# Altium project Servo-Board-v1.0.PrjPcb (part 17 of 19)

## Sheet Sec_Controller_Sheet4.SchDoc
size 420 x 297 mm; SheetNumber: 28; SheetTotal: 32
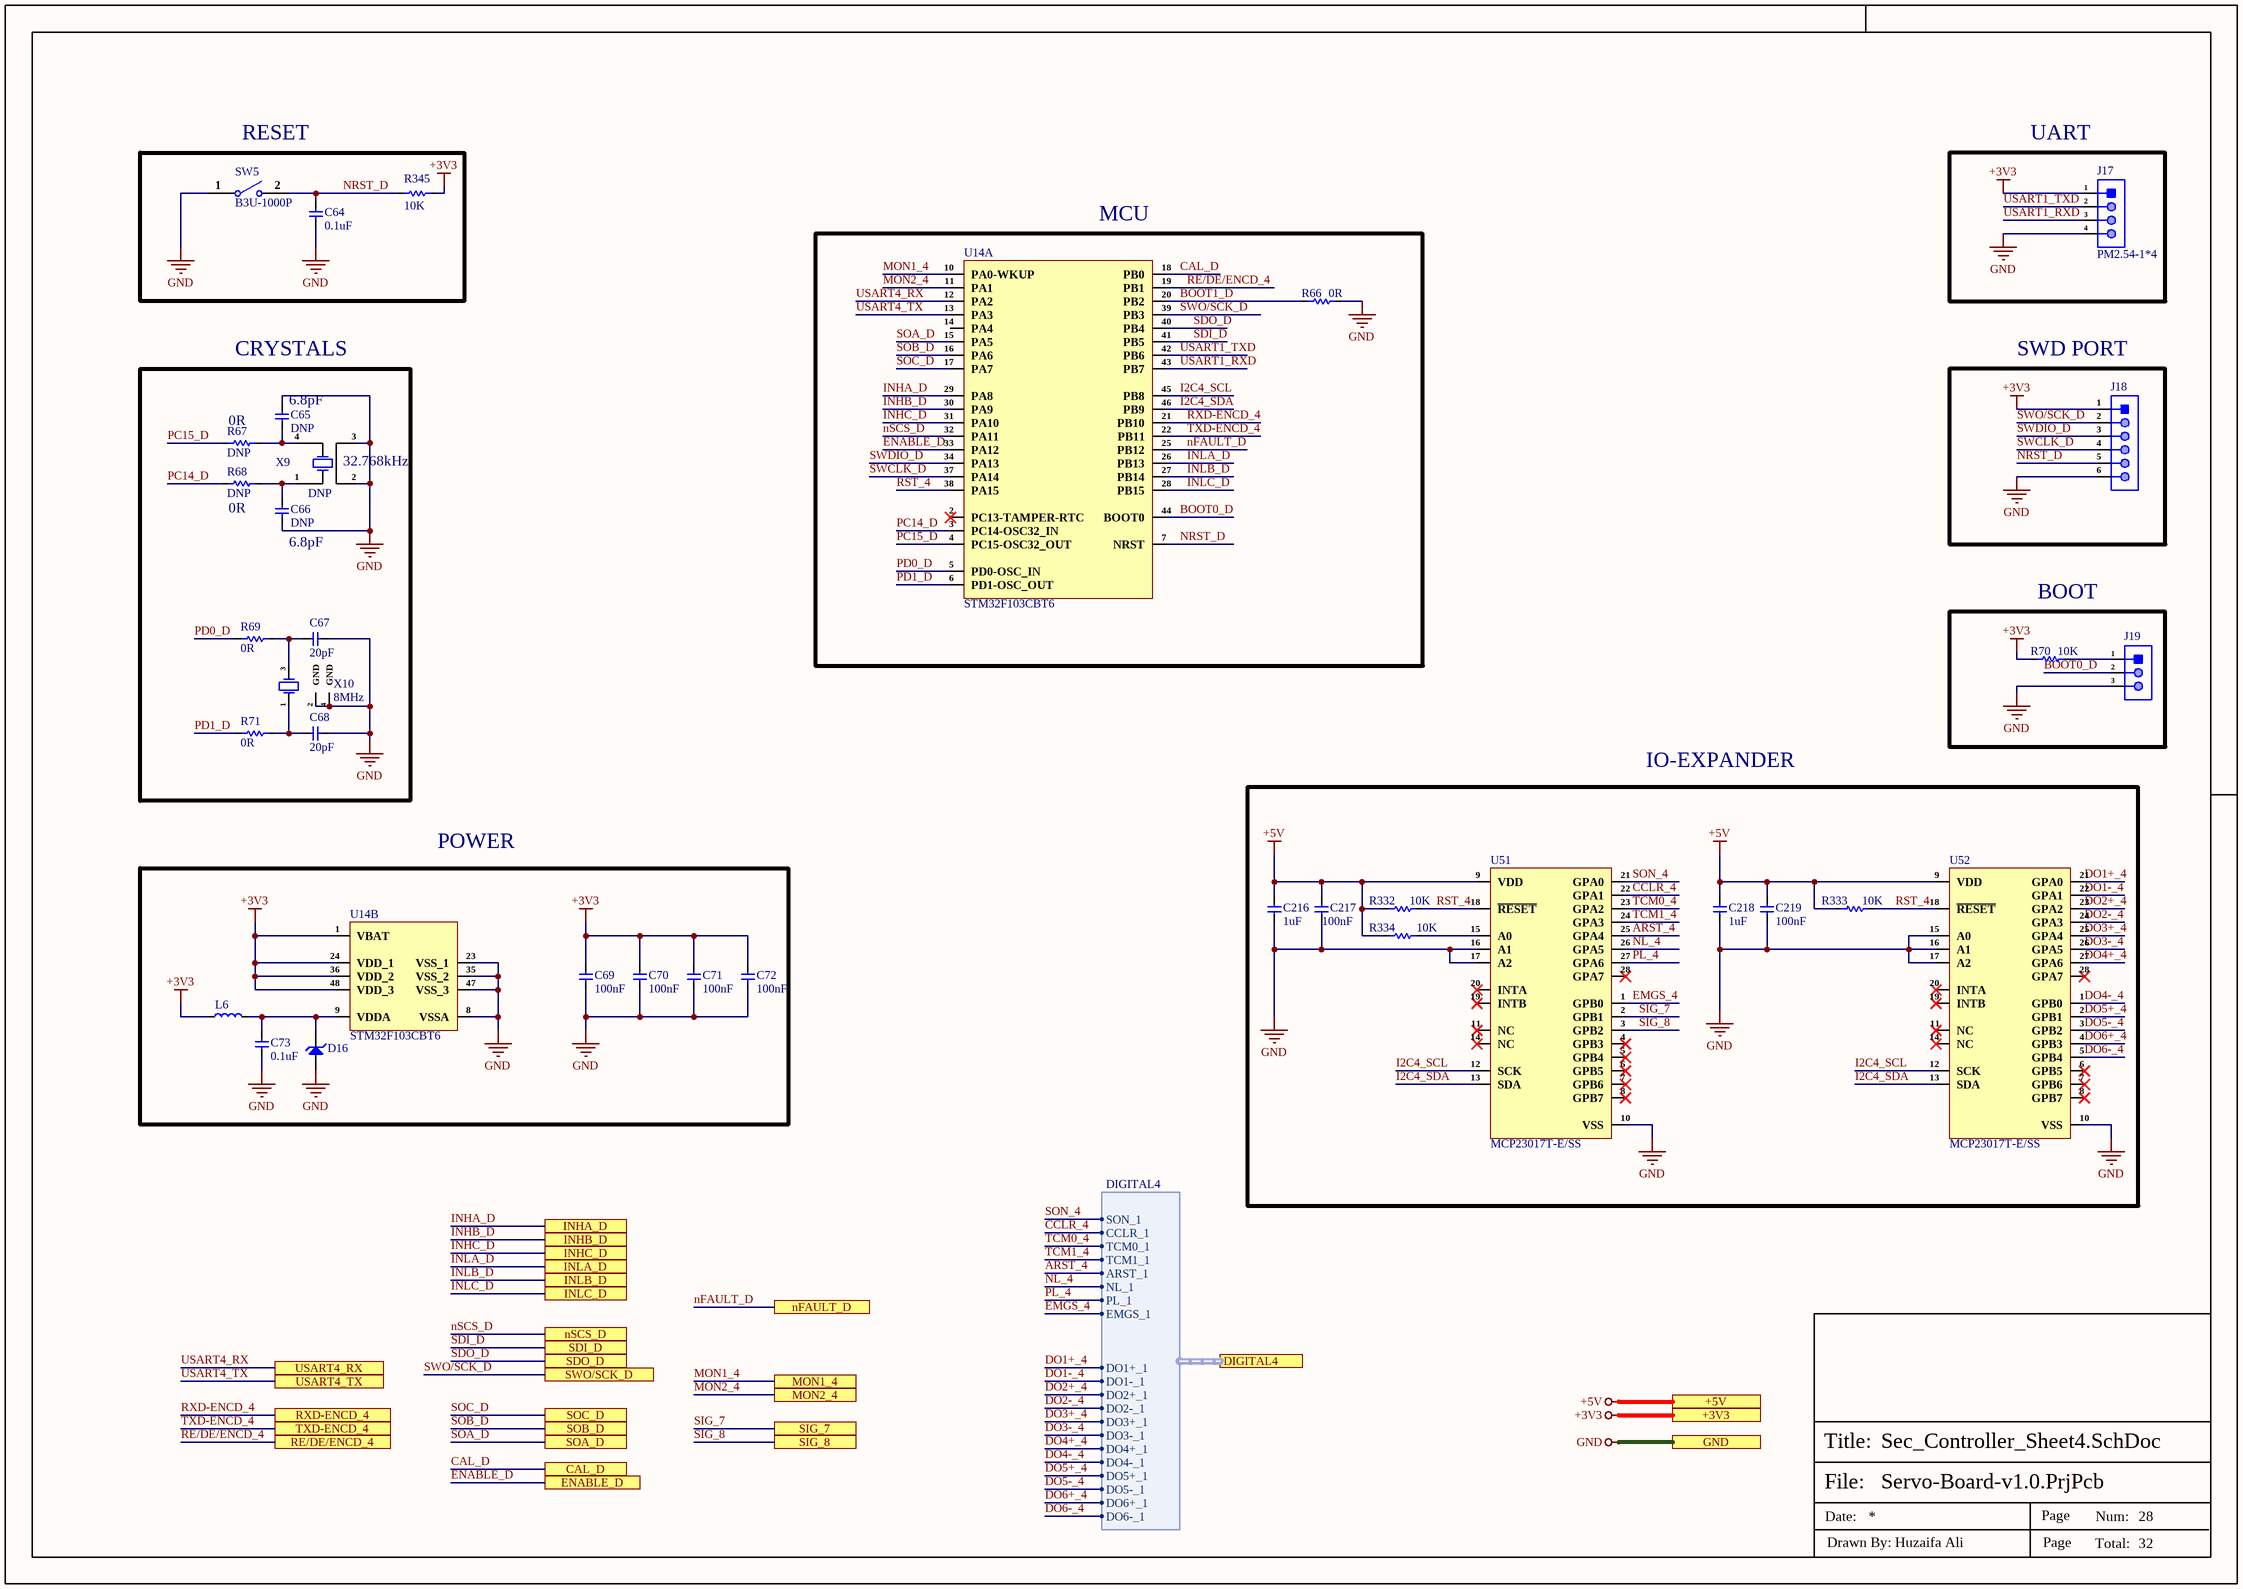
[diagram p29: Sec_Controller_Sheet4.SchDoc]

### Parts
C64  0.1uF  [Cap-0402]
C65  DNP  [Cap-0402]
C66  DNP  [Cap-0402]
C67  20pF  [Cap-0402]
C68  20pF  [Cap-0402]
C69  100nF  [cap-0402]
C70  100nF  [cap-0402]
C71  100nF  [cap-0402]
C72  100nF  [cap-0402]
C73  0.1uF  [Cap-0402]
C216  1uF  [Cap-0402]
C217  100nF  [cap-0402]
C218  1uF  [Cap-0402]
C219  100nF  [cap-0402]
D16  AZ3003-01G  [SOD-123]  (value not drawn)
J17  PM2.54-1*4  [HDR1X4 Female]
J18  X6511WV-06H-C60D30  [HDR1X6_]  (value not drawn)
J19  68000-103HLF  [HDR1X3_]  (value not drawn)
L6  BLM15AG601SN1D  [IND-0402]  (value not drawn)
R66  0R  [Res-0402]
R67  DNP  [Res-0603]
R68  DNP  [Res-0603]
R69  0R  [Res-0603]
R70  10K  [Res-0402]
R71  0R  [Res-0603]
R332  10K  [Res-0402]
R333  10K  [Res-0402]
R334  10K  [Res-0402]
R345  10K  [Res-0402]
SW5  B3U-1000P  [B3U-1000P]
U14  STM32F103CBT6  [48-LQFP (7x7)_]  (parts A,B of 2)
U51  MCP23017T-E/SS  [SSOP-28-208mil]
U52  MCP23017T-E/SS  [SSOP-28-208mil]
X9  DNP  [MC-306]
X10  8MHz  [5TJ480000XYLBC_]

### Blocks framed on the sheet
RESET: C64 R345 SW5
UART: J17
MCU: R66 U14
CRYSTALS: C65-C68 R67-R69 R71 X9 X10
SWD PORT: J18
BOOT: J19 R70
IO-EXPANDER: C216-C219 R332-R334 U51 U52
POWER: C69-C73 D16 L6 U14

### Ports
+3V3 (see Servo4[2A], CAN_Sheet[5D], Connector_Sheet[5D], Controller_Sheet[5D], Encoder_Sheet1[5D], Encoder_Sheet2[5D], Encoder_Sheet3[5D], Encoder_Sheet4[5D], EtherCAT_Sheet[5D], Motor_Driver_Sheet1[5D], Motor_Driver_Sheet2[5D], Motor_Driver_Sheet3[5D], Motor_Driver_Sheet4[5D], Power_Sheet[5D], RJ45_Sheet[5D], RS485_RS232_Sheet[3D], Sec_Controller_Sheet1[5D], Sec_Controller_Sheet2[5D], Sec_Controller_Sheet3[5D]), +5V, CAL_D (see Servo4[2B], Motor_Driver_Sheet4[3D]), DIGITAL4 (harness DIGITAL4, see Servo4[2B], DIO_4[4D]), ENABLE_D (see Servo4[2B], Motor_Driver_Sheet4[3D]), GND (see Servo4[2B], CAN_Sheet[5D], Connector_Sheet[5D], Controller_Sheet[5D], DIO_1[5D], DIO_2[5D], DIO_3[5D], DIO_4[5D], Encoder_Sheet1[5D], Encoder_Sheet2[5D], Encoder_Sheet3[5D], Encoder_Sheet4[5D], EtherCAT_Sheet[5D], MOSFET_Driver_Sheet1[5D], MOSFET_Driver_Sheet2[5D], MOSFET_Driver_Sheet3[5D], MOSFET_Driver_Sheet4[5D], Motor_Driver_Sheet1[5D], Motor_Driver_Sheet2[5D], Motor_Driver_Sheet3[5D], Motor_Driver_Sheet4[5D], Power_Sheet[5D], RJ45_Sheet[5D], RS485_RS232_Sheet[3D], Sec_Controller_Sheet1[5D], Sec_Controller_Sheet2[5D], Sec_Controller_Sheet3[5D]), INHA_D (see Servo4[2B], Motor_Driver_Sheet4[3D]), INHB_D (see Servo4[2B], Motor_Driver_Sheet4[3D]), INHC_D (see Servo4[2B], Motor_Driver_Sheet4[3D]), INLA_D (see Servo4[2B], Motor_Driver_Sheet4[3D]), INLB_D (see Servo4[2B], Motor_Driver_Sheet4[3D]), INLC_D (see Servo4[2B], Motor_Driver_Sheet4[3D]), MON1_4 (see Servo4[2B], DIO_4[3D]), MON2_4 (see Servo4[2B], DIO_4[3D]), nFAULT_D (see Servo4[2B], Motor_Driver_Sheet4[3D]), nSCS_D (see Servo4[2B], Motor_Driver_Sheet4[3D]), RE/DE/ENCD_4 (see Servo4[2B], Encoder_Sheet4[3D]), RXD-ENCD_4 (see Servo4[2B], Encoder_Sheet4[3D]), SDI_D (see Servo4[2B], Motor_Driver_Sheet4[3D]), SDO_D (see Servo4[2B], Motor_Driver_Sheet4[3D]), SIG_7 (see Servo4[2B], DIO_4[2D]), SIG_8 (see Servo4[2B], DIO_4[2D]), SOA_D (see Servo4[2B], Motor_Driver_Sheet4[3D]), SOB_D (see Servo4[2B], Motor_Driver_Sheet4[3D]), SOC_D (see Servo4[2B], Motor_Driver_Sheet4[3D]), SWO/SCK_D (see Servo4[2B], Motor_Driver_Sheet4[3D]), TXD-ENCD_4 (see Servo4[2B], Encoder_Sheet4[3D]), USART4_RX (see Servo4[2B], Controller_Sheet[2D], Servo4[1B]), USART4_TX (see Servo4[2B], Controller_Sheet[2D], Servo4[1B])

### Harnesses
DIGITAL4: SON_1, TCM0_1, CCLR_1, TCM1_1, ARST_1, NL_1, PL_1, EMGS_1, DO1+_1, DO1-_1, DO2+_1, DO2-_1, DO3+_1, DO3-_1, DO4+_1, DO4-_1, DO5+_1, DO5-_1, DO6+_1, DO6-_1

### Nets
+3V3: C69.2 C70.2 C71.2 C72.2 J17.1 J18.1 L6.1 R70.2 R345.2 U14.1(VBAT) U14.24(VDD_1) U14.36(VDD_2) U14.48(VDD_3) ; port +3V3
+5V: C216.2 C217.2 C218.2 C219.2 R332.2 R333.2 R334.2 U51.9(VDD) U52.9(VDD) ; port +5V
GND: C64.1 C65.2 C66.1 C67.2 C68.2 C69.1 C70.1 C71.1 C72.1 C73.1 C216.1 C217.1 C218.1 C219.1 D16.1(A) J17.4 J18.6 J19.3 R66.2 SW5.1 U14.8(VSSA) U14.23(VSS_1) U14.35(VSS_2) U14.47(VSS_3) U51.10(VSS) U51.16(A1) U51.17(A2) U52.10(VSS) U52.15(A0) U52.16(A1) U52.17(A2) X9.2 X9.3 X10.2(GND) X10.4(GND) ; port GND
ARST_4: U51.25(GPA4) ; port DIGITAL4.ARST_1
BOOT0_D: J19.2 U14.44(BOOT0)
BOOT1_D: R66.1 U14.20(PB2)
CAL_D: U14.18(PB0) ; port CAL_D
CCLR_4: U51.22(GPA1) ; port DIGITAL4.CCLR_1
DO1+_4: U52.21(GPA0) ; port DIGITAL4.DO1+_1
DO1-_4: U52.22(GPA1) ; port DIGITAL4.DO1-_1
DO2+_4: U52.23(GPA2) ; port DIGITAL4.DO2+_1
DO2-_4: U52.24(GPA3) ; port DIGITAL4.DO2-_1
DO3+_4: U52.25(GPA4) ; port DIGITAL4.DO3+_1
DO3-_4: U52.26(GPA5) ; port DIGITAL4.DO3-_1
DO4+_4: U52.27(GPA6) ; port DIGITAL4.DO4+_1
DO4-_4: U52.1(GPB0) ; port DIGITAL4.DO4-_1
DO5+_4: U52.2(GPB1) ; port DIGITAL4.DO5+_1
DO5-_4: U52.3(GPB2) ; port DIGITAL4.DO5-_1
DO6+_4: U52.4(GPB3) ; port DIGITAL4.DO6+_1
DO6-_4: U52.5(GPB4) ; port DIGITAL4.DO6-_1
EMGS_4: U51.1(GPB0) ; port DIGITAL4.EMGS_1
ENABLE_D: U14.33(PA12) ; port ENABLE_D
I2C4_SCL: U14.45(PB8) U51.12(SCK) U52.12(SCK)
I2C4_SDA: U14.46(PB9) U51.13(SDA) U52.13(SDA)
INHA_D: U14.29(PA8) ; port INHA_D
INHB_D: U14.30(PA9) ; port INHB_D
INHC_D: U14.31(PA10) ; port INHC_D
INLA_D: U14.26(PB13) ; port INLA_D
INLB_D: U14.27(PB14) ; port INLB_D
INLC_D: U14.28(PB15) ; port INLC_D
MON1_4: U14.10(PA0-WKUP) ; port MON1_4
MON2_4: U14.11(PA1) ; port MON2_4
nFAULT_D: U14.25(PB12) ; port nFAULT_D
NL_4: U51.26(GPA5) ; port DIGITAL4.NL_1
NRST_D: C64.2 J18.5 R345.1 SW5.2 U14.7(NRST)
nSCS_D: U14.32(PA11) ; port nSCS_D
PC14_D: R68.2 U14.3(PC14-OSC32_IN)
PC15_D: R67.2 U14.4(PC15-OSC32_OUT)
PD0_D: R69.2 U14.5(PD0-OSC_IN)
PD1_D: R71.2 U14.6(PD1-OSC_OUT)
PL_4: U51.27(GPA6) ; port DIGITAL4.PL_1
RE/DE/ENCD_4: U14.19(PB1) ; port RE/DE/ENCD_4
RST_4: R332.1 R333.1 U14.38(PA15) U51.18(~{RESET}) U52.18(~{RESET})
RXD-ENCD_4: U14.21(PB10) ; port RXD-ENCD_4
SDI_D: U14.41(PB5) ; port SDI_D
SDO_D: U14.40(PB4) ; port SDO_D
SIG_7: U51.2(GPB1) ; port SIG_7
SIG_8: U51.3(GPB2) ; port SIG_8
SOA_D: U14.15(PA5) ; port SOA_D
SOB_D: U14.16(PA6) ; port SOB_D
SOC_D: U14.17(PA7) ; port SOC_D
SON_4: U51.21(GPA0) ; port DIGITAL4.SON_1
SWCLK_D: J18.4 U14.37(PA14)
SWDIO_D: J18.3 U14.34(PA13)
SWO/SCK_D: J18.2 U14.39(PB3) ; port SWO/SCK_D
TCM0_4: U51.23(GPA2) ; port DIGITAL4.TCM0_1
TCM1_4: U51.24(GPA3) ; port DIGITAL4.TCM1_1
TXD-ENCD_4: U14.22(PB11) ; port TXD-ENCD_4
USART1_RXD: J17.3 U14.43(PB7)
USART1_TXD: J17.2 U14.42(PB6)
USART4_RX: U14.12(PA2) ; port USART4_RX
USART4_TX: U14.13(PA3) ; port USART4_TX
NetC65_1: C65.1 R67.1 X9.4(OSC2)
NetC66_2: C66.2 R68.1 X9.1(OSC1)
NetC67_1: C67.1 R69.1 X10.3(OSC2)
NetC68_1: C68.1 R71.1 X10.1(OSC1)
NetC73_2: C73.2 D16.2(K) L6.2 U14.9(VDDA)
NetJ19_1: J19.1 R70.1
NetR334_1: R334.1 U51.15(A0)

Not connected (* = marked no-connect by the designer): U14 2(PC13-TAMPER-RTC)* 14(PA4); U51 4(GPB3)* 5(GPB4)* 6(GPB5)* 7(GPB6)* 8(GPB7)* 11(NC)* 14(NC)* 19(INTB)* 20(INTA)* 28(GPA7)*; U52 6(GPB5)* 7(GPB6)* 8(GPB7)* 11(NC)* 14(NC)* 19(INTB)* 20(INTA)* 28(GPA7)*

### Notes on the sheet
- (near R67) 0R
- (near C65) 6.8pF
- (near R68) 0R
- (near X9) 32.768kHz
- (near C66) 6.8pF
- File:
- Title:
- Date:
- Page
- Num:
- Total:
- Drawn By: Huzaifa Ali

### Library data of the parts
C64 C73 = CC0402JRX7R7BB104: as C54 on sheet Sec_Controller_Sheet3; Supplier: Digikey; Supplier Part Number: 311-1676-1-ND; Manufacturer Part Number: CC0402JRX7R7BB104; RoHS: Yes; Category: Ceramic Capacitors; Stock: 1659111; Pricing: 1=0.1, 10=0.046, 50=0.0262, 100=0.0203, 500=0.01528, 1000=0.012, 2500=0.01091, 5000=0.01004 (USD); Mounting Technology: Surface Mount; Case/Package: 0402; Case Code (Metric): 1005; Case Code (Imperial): 0402; Min Operating Temperature: -55°C; Max Operating Temperature: 125°C; Dielectric: X7R; Packaging: Tape and Reel; Package Quantity: 10000; Voltage Rating (DC): 16V; Voltage Rating: 16V; Series: CC; Construction: Flat; Length: 0.039inch; Width: 0.02inch; Height: 0.5mm; Thickness: 0.022inch; Lead Free: Lead Free; Halogen Free: Halogen Free; RoHS Compliant: Yes; ComponentLink1URL: https://datasheet.ciiva.com/13210/upy-gphc-x7r-6-3v-to-50v-8-12304-13210152.pdf?src-supplier=Mouser; ComponentLink1Description: https://datasheet.ciiva.com/13210/upy-gphc-x7r-6-3v-to-50v-8-12304-13210152.pdf?src-supplier=Mouser; LCSC Part Number: C541464
C65 C66 = CC0402CRNPO9BN6R8: as C55 on sheet Sec_Controller_Sheet3; Supplier: Future Electronics; Supplier Part Number: 3247368; Manufacturer Part Number: CC0402CRNPO9BN6R8; RoHS: Yes; Category: Ceramic Capacitors; Stock: 200000; Pricing: 10000=0.0024, 40000=0.0022, 150000=0.0021, 400000=0.002, 1000000=0.0019 (USD); Mounting Technology: Surface Mount; Case/Package: 0402; Case Code (Imperial): 0402; Case Code (Metric): 1005; Weight: 2.3E-05oz; Min Operating Temperature: -55°C; Max Operating Temperature: 125°C; Value: 6.8pF; Packaging: Tape and Reel; Voltage Rating: 50V; Voltage Rating (DC): 50V; Termination: SMD/SMT; Series: CC; Construction: Flat; Length: 1mm; Width: 0.5mm; Height: 0.5mm; Depth: 0.5mm; Radiation Hardening: No; RoHS Compliant: Yes; ComponentLink1URL: https://datasheet.ciiva.com/11587/upy-gp-np0-16v-to-50v-8-11587182.pdf?src-supplier=Avnet; ComponentLink1Description: https://datasheet.ciiva.com/11587/upy-gp-np0-16v-to-50v-8-11587182.pdf?src-supplier=Avnet; LCSC Part Number: C189470
C67 C68 = CC0402JRNPO9BN200: as C57 on sheet Sec_Controller_Sheet3; Supplier: Avnet; LCSC Part Number: C107000; Manufacturer Part Number: CC0402JRNPO9BN200; RoHS: Yes; Stock: 20000; Pricing: 10000=0.00221 (USD); Halogen Free: 5694HalogenFree; ComponentLink1URL: https://datasheet.ciiva.com/176/mlccorderingcode-176360.pdf?src-supplier=Digikey; ComponentLink1Description: https://datasheet.ciiva.com/176/mlccorderingcode-176360.pdf?src-supplier=Digikey; ComponentLink2URL: https://datasheet.ciiva.com/176/mlccorderingcode-176361.pdf?src-supplier=Digikey; ComponentLink2Description: https://datasheet.ciiva.com/176/mlccorderingcode-176361.pdf?src-supplier=Digikey; ComponentLink3URL: https://datasheet.ciiva.com/176/mlccorderingcode-176362.pdf?src-supplier=Digikey; ComponentLink3Description: https://datasheet.ciiva.com/176/mlccorderingcode-176362.pdf?src-supplier=Digikey; ComponentLink4URL: https://datasheet.ciiva.com/7656/1132289-7656614.pdf?src-supplier=Element14; ComponentLink4Description: https://datasheet.ciiva.com/7656/1132289-7656614.pdf?src-supplier=Element14; ComponentLink5URL: https://datasheet.ciiva.com/5427/upy-gp-np0-16v-to-50v-8-3714-5427769.pdf?src-supplier=Mouser; ComponentLink5Description: https://datasheet.ciiva.com/5427/upy-gp-np0-16v-to-50v-8-3714-5427769.pdf?src-supplier=Mouser
C69-C72 C217 C219 = C1005X7R1H104KT000F: as C59-C62 on sheet Sec_Controller_Sheet3; Supplier 1: Avnet; Manufacturer Part Number: C1005X7R1H104KT000F; RoHS: No; Category: Ceramic Capacitors; Dielectric: X7R; Supplier Part Number 1: C1005X7R1H104KT000F; LCSC Part Number: C361198; ComponentLink1Description: LCSC; ComponentLink1URL: https://www.lcsc.com/product-detail/Multilayer-Ceramic-Capacitors-MLCC-SMD-SMT_TDK-C1005X7R1H104KT000F_C361198.html
C216 C218 = CC0402KRX5R6BB105: as C212 on sheet Sec_Controller_Sheet3; Supplier 1: Mouser; Manufacturer Part Number: CC0402KRX5R6BB105; RoHS: Yes; Category: Ceramic Capacitors; Stock 1: 6711367; Pricing 1: 1=0.11000, 10=0.05500, 50=0.05500, 100=0.03300, 500=0.02700, 1000=0.02200, 2500=0.02100, 10000=0.01800 (USD); Mount: Surface Mount; Case/Package: 0402; Number of Pins: 2; Case Code (Metric): 1005; Case Code (Imperial): 0402; Min Operating Temperature: -55°C; Max Operating Temperature: 85°C; Capacitance: 1uF; Dielectric: X5R; Package Quantity: 1; Voltage Rating: 10V; Packaging: Tape and Reel; Voltage Rating (DC): 10V; Termination: SMD/SMT; Resistor Type: Ceramic; Series: CC; Construction: Flat; Length: 1mm; Width: 0.02inch; Height: 0.5mm; Thickness: 0.022inch; Depth: 0.5mm; Radiation Hardening: No; REACH SVHC: No SVHC; Lead Free: Lead Free; Halogen Free: Halogen Free; RoHS Compliant: Yes; ComponentLink1URL: https://datasheet.ciiva.com/176/upy-gphc-x5r-4v-to-50v-12-176704.pdf?src-supplier=Digi-Key; ComponentLink1Description: https://datasheet.ciiva.com/176/upy-gphc-x5r-4v-to-50v-12-176704.pdf?src-supplier=Digi-Key; ComponentLink2URL: https://datasheet.ciiva.com/176/mlccorderingcode-176705.pdf?src-supplier=Digi-Key; ComponentLink2Description: https://datasheet.ciiva.com/176/mlccorderingcode-176705.pdf?src-supplier=Digi-Key; ComponentLink3URL: https://datasheet.ciiva.com/176/mlccorderingcode-176706.pdf?src-supplier=Digi-Key; ComponentLink3Description: https://datasheet.ciiva.com/176/mlccorderingcode-176706.pdf?src-supplier=Digi-Key; Supplier Part Number 1: 603-CC402KRX5R6BB105; LCSC Part Number: C106254
D16 = AZ3003-01G: as D15 on sheet Sec_Controller_Sheet3; Manufacturer Part Number: AZ3003-01G; Package: SOD-123; LCSC Part Number: -; ComponentLink1Description: Digikey; ComponentLink1URL: https://www.digikey.com/en/products/detail/amazing/AZ3003-01G/16615352?s=N4IgTCBcDaIIIC0DMAGFSC0KCMBxEAugL5A
J17 = PM2.54-1*4: as J14 on sheet Sec_Controller_Sheet3; Manufacturer Part Number: PM2.54-1*4; Package: Plugin,P=2.54mm; LCSC Part Number: C5116530; Item Type: Female Header; ComponentLink1Description: LCSC; ComponentLink1URL: https://www.lcsc.com/product-detail/span-style-background-color-ff0-Female-span-Headers_ZHOURI-PM2-54-1-4_C5116530.html
J18 = X6511WV-06H-C60D30: as J15 on sheet Sec_Controller_Sheet3; Manufacturer Part Number: X6511WV-06H-C60D30; Package: Plugin,P=2.54mm; LCSC Part Number: C706878; ComponentLink1Description: LCSC; ComponentLink1URL: https://www.lcsc.com/product-detail/Pin-Headers_XKB-Connectivity-X6511WV-06H-C60D30_C706878.html
J19 = 68000-103HLF: as J16 on sheet Sec_Controller_Sheet3; LCSC Part Number: C168677; ComponentLink1Description: LCSC; Supplier: Avnet; Supplier Part Number: 88K1775; RoHS: No; Category: Headers and Wire Housings; Stock: 2805; Pricing: 1=0.395, 10=0.31, 25=0.29, 50=0.27, 100=0.25 (USD); Contact Plating: Gold,GXT; Contact Material: Bronze; Housing Material: Thermoplastic; Housing Color: Black; Min Operating Temperature: -65°C; Max Operating Temperature: 125°C; Number of Rows: 1; Termination: Through Hole; Packaging: Bulk; Number of Contacts: 3; Contact Gender: Male; Orientation: Straight; Max Voltage Rating (AC): 1.5kV; Package Quantity: 100; Series: 68000; Length: 7.62mm; Pitch: 2.54mm; Contact Mating Length: 5.84mm; Depth: 2.41mm; Radiation Hardening: No; Flammability Rating: UL94 V-0; Reach SVHC Compliant: No; ComponentLink2URL: https://datasheet.ciiva.com/46392/1914865-46392021.pdf?src-supplier=Element14; ComponentLink2Description: https://datasheet.ciiva.com/46392/1914865-46392021.pdf?src-supplier=Element14
L6 = BLM15AG601SN1D: as L5 on sheet Sec_Controller_Sheet3; Supplier 1: Digi-Key; Manufacturer Part Number: BLM15AG601SN1D; RoHS: Yes; Category: Inductors; Stock 1: 4108655; Pricing 1: 1=0.10000, 10=0.06500, 25=0.05760, 50=0.05240, 100=0.04710, 250=0.03456, 500=0.02514, 1000=0.02461, 5000=0.01676 (USD); Case/Package: 0402; Number of Pins: 2; Core Material: Ferrite; Case Code (Metric): 1005; Case Code (Imperial): 0402; Min Operating Temperature: -55°C; Max Operating Temperature: 125°C; Package Quantity: 10000; Packaging: Tape and Reel; Current Rating: 300mA; Max Current Rating: 300mA; Termination: SMD/SMT; DC Current: 300mA; Frequency: 100MHz; Number of Circuits: 1; Series: BLM15AG_SN; Length: 1mm; Width: 0.5mm; Height: 0.5mm; Depth: 0.55mm; Radiation Hardening: No; REACH SVHC: No SVHC; Military Standard: Not; Lead Free: Lead Free; RoHS Compliant: Yes; ComponentLink1URL: https://datasheet.ciiva.com/11799/0900766b811b5866-11799226.pdf?src-supplier=RSComponents; ComponentLink1Description: https://datasheet.ciiva.com/11799/0900766b811b5866-11799226.pdf?src-supplier=RSComponents; ComponentLink2URL: https://datasheet.ciiva.com/41449/001172163-da-01-en-drossel-0402-600r-1-0x0-5mm-10000st-41449450.pdf?src-supplier=Conrad; ComponentLink2Description: https://datasheet.ciiva.com/41449/001172163-da-01-en-drossel-0402-600r-1-0x0-5mm-10000st-41449450.pdf?src-supplier=Conrad; ComponentLink3URL: https://datasheet.ciiva.com/29347/442210-da-01-en-chip-drossel-0402-600r-300ma-1-0x0-5mm-29347879.pdf?src-supplier=Conrad; ComponentLink3Description: https://datasheet.ciiva.com/29347/442210-da-01-en-chip-drossel-0402-600r-300ma-1-0x0-5mm-29347879.pdf?src-supplier=Conrad; ComponentLink4URL: https://datasheet.ciiva.com/1466/5144-1466744.pdf?src-supplier=Element14; ComponentLink4Description: https://datasheet.ciiva.com/1466/5144-1466744.pdf?src-supplier=Element14; ComponentLink5URL: https://datasheet.ciiva.com/1466/5144-1466745.pdf?src-supplier=Element14; ComponentLink5Description: https://datasheet.ciiva.com/1466/5144-1466745.pdf?src-supplier=Element14; ComponentLink6URL: https://datasheet.ciiva.com/14122/blm-series-eng-tds-14122894.pdf?src-supplier=Distrelec; ComponentLink6Description: https://datasheet.ciiva.com/14122/blm-series-eng-tds-14122894.pdf?src-supplier=Distrelec; ComponentLink7URL: https://datasheet.ciiva.com/6212/l0110s0100blm15ag-sn-6212519.pdf?src-supplier=Digi-Key; ComponentLink7Description: https://datasheet.ciiva.com/6212/l0110s0100blm15ag-sn-6212519.pdf?src-supplier=Digi-Key; ComponentLink8URL: https://datasheet.ciiva.com/6212/l0110s0100blm15ag-sn-6212565.pdf?src-supplier=Digi-Key; ComponentLink8Description: https://datasheet.ciiva.com/6212/l0110s0100blm15ag-sn-6212565.pdf?src-supplier=Digi-Key; ComponentLink9URL: https://datasheet.ciiva.com/6212/l0110s0100blm15ag-sn-6212520.pdf?src-supplier=Digi-Key; ComponentLink9Description: https://datasheet.ciiva.com/6212/l0110s0100blm15ag-sn-6212520.pdf?src-supplier=Digi-Key; ComponentLink10URL: https://datasheet.ciiva.com/8084/l0110s0100blm15ag-sn-8084271.pdf?src-supplier=Avnet; ComponentLink10Description: https://datasheet.ciiva.com/8084/l0110s0100blm15ag-sn-8084271.pdf?src-supplier=Avnet; ComponentLink11URL: https://datasheet.ciiva.com/8510/l0110s0100blm15ag-sn-8510909.pdf?src-supplier=Avnet; ComponentLink11Description: https://datasheet.ciiva.com/8510/l0110s0100blm15ag-sn-8510909.pdf?src-supplier=Avnet; Supplier Part Number 1: 490-1006-1-ND; LCSC Part Number: C76884; Item Type: Ferrite Bead
R66 = RC0402FR-070RL: as R60 on sheet Sec_Controller_Sheet3; Supplier 1: Mouser; Manufacturer Part Number: RC0402FR-070RL; RoHS: Yes; Stock 1: 8556842; Pricing 1: 1=0.10000, 10=0.01400, 50=0.01400, 100=0.00600, 1000=0.00300, 5000=0.00200, 10000=0.00100 (USD); Mount: Surface Mount; Case/Package: 0402; Contact Plating: Tin,Matte; Case Code (Imperial): 0402; Case Code (Metric): 1005; Size Code: 0402; Min Operating Temperature: -55°C; Max Operating Temperature: 155°C; Resistance: 0R; Resistor Type: Thick Film; Packaging: Tape and Reel; Termination: SMD/SMT; Features: Moisture Resistant; Series: RC; Number of Terminations: 2; Length: 1mm; Width: 0.5mm; Height: 0.35mm; Radiation Hardening: No; Lead Free: Lead Free; RoHS Compliant: Yes; ComponentLink1URL: https://datasheet.ciiva.com/8896/pyu-rc0402-51-rohs-l-6-8896149.pdf?src-supplier=Avnet; ComponentLink1Description: https://datasheet.ciiva.com/8896/pyu-rc0402-51-rohs-l-6-8896149.pdf?src-supplier=Avnet; ComponentLink2URL: https://datasheet.ciiva.com/16790/pyu-rc0402-51-rohs-l-6-r-16790444.pdf?src-supplier=Future+Electronics; ComponentLink2Description: https://datasheet.ciiva.com/16790/pyu-rc0402-51-rohs-l-6-r-16790444.pdf?src-supplier=Future+Electronics; Supplier Part Number 1: 603-RC0402FR-070RL; LCSC Part Number: C106231
R67-R69 R71 = RC0603JR-070RL: as R61-R63 on sheet Sec_Controller_Sheet3; Supplier 1: Digi-Key; Manufacturer Part Number: RC0603JR-070RL; RoHS: Yes; Category: Chip SMD Resistors; Stock 1: 18081776; Pricing 1: 1=0.10000, 10=0.01700, 25=0.01240, 50=0.00960, 100=0.00700, 250=0.00536, 500=0.00430, 1000=0.00316 (USD); Case/Package: 0603; Number of Pins: 2; Contact Plating: Tin,Matte; Case Code (Imperial): 0603; Case Code (Metric): 1608; Size Code: 0603; Min Operating Temperature: -55°C; Max Operating Temperature: 155°C; Resistor Type: Thick Film; Packaging: Tape and Reel; Termination: SMD/SMT; Series: RC; Technology: THICK FILM; Package Quantity: 5000; Voltage Rating: 50V; Features: Moisture Resistant; Max Power Dissipation: 100mW; Number of Terminations: 2; Construction: Rectangular; Length: 1.6mm; Width: 0.8mm; Height: 0.45mm; Depth: 0.8mm; Radiation Hardening: No; Reach SVHC Compliant: No SVHC; Lead Free: Lead Free; RoHS Compliant: Yes; Military Standard: Not; Supplier Part Number 1: 311-0.0GRCT-ND; LCSC Part Number: C95177
R70 R332-R334 R345 = RC0402FR-0710KL: as R64 on sheet Sec_Controller_Sheet3; Supplier 1: Mouser; Manufacturer Part Number: RC0402FR-0710KL; RoHS: Yes; Category: Chip SMD Resistors; Stock 1: 18648329; Pricing 1: 1=0.10000, 10=0.01400, 50=0.01400, 100=0.00500, 1000=0.00300, 10000=0.00200 (USD); Case/Package: 0402; Number of Pins: 2; Case Code (Imperial): 0402; Case Code (Metric): 1005; Min Operating Temperature: -55°C; Max Operating Temperature: 155°C; Resistor Type: Thick Film; Tolerance: 1%; Packaging: Tape and Reel; Voltage Rating: 50V; Termination: SMD/SMT; Working Voltage: 50V; Number of Terminations: 2; Features: Moisture Resistant; Series: RC; Resistance Tolerance: 1%; Construction: Rectangular; Length: 1mm; Width: 0.5mm; Height: 0.32mm; Depth: 0.5mm; Lead Pitch: 0.2mm; REACH SVHC: No SVHC; Lead Free: Lead Free; RoHS Compliant: Yes; Military Standard: Not; ComponentLink1URL: https://datasheet.ciiva.com/7660/38568-7660787.pdf?src-supplier=Element14; ComponentLink1Description: https://datasheet.ciiva.com/7660/38568-7660787.pdf?src-supplier=Element14; ComponentLink2URL: https://datasheet.ciiva.com/7849/1686128-7849814.pdf?src-supplier=Element14; ComponentLink2Description: https://datasheet.ciiva.com/7849/1686128-7849814.pdf?src-supplier=Element14; ComponentLink3URL: https://datasheet.ciiva.com/7983/1018594-7983486.pdf?src-supplier=Element14; ComponentLink3Description: https://datasheet.ciiva.com/7983/1018594-7983486.pdf?src-supplier=Element14; ComponentLink4URL: https://datasheet.ciiva.com/22747/1018594-22747512.pdf?src-supplier=Element14; ComponentLink4Description: https://datasheet.ciiva.com/22747/1018594-22747512.pdf?src-supplier=Element14; ComponentLink5URL: https://datasheet.ciiva.com/12667/pyu-rc0402-51-rohs-l-6-r-12667067.pdf?src-supplier=Mouser; ComponentLink5Description: https://datasheet.ciiva.com/12667/pyu-rc0402-51-rohs-l-6-r-12667067.pdf?src-supplier=Mouser; ComponentLink6URL: https://datasheet.ciiva.com/7849/1784430-7849813.pdf?src-supplier=Element14; ComponentLink6Description: https://datasheet.ciiva.com/7849/1784430-7849813.pdf?src-supplier=Element14; ComponentLink7URL: https://datasheet.ciiva.com/7849/1784430-7849815.pdf?src-supplier=Element14; ComponentLink7Description: https://datasheet.ciiva.com/7849/1784430-7849815.pdf?src-supplier=Element14; Supplier Part Number 1: 603-RC0402FR-0710KL; LCSC Part Number: C60490
SW5 = B3U-1000P: as SW4 on sheet Sec_Controller_Sheet3; ComponentLink1URL: http://www.farnell.com/datasheets/60838.pdf?src-supplier=Farnell; ComponentLink1Description: http://www.farnell.com/datasheets/60838.pdf?src-supplier=Farnell; ComponentLink2URL: http://www.farnell.com/datasheets/60838.pdf?src-supplier=Element14; ComponentLink2Description: http://www.farnell.com/datasheets/60838.pdf?src-supplier=Element14; ComponentLink3URL: https://omronfs.omron.com/en_US/ecb/products/pdf/en-b3u.pdf?src-supplier=Digi-Key; ComponentLink3Description: https://omronfs.omron.com/en_US/ecb/products/pdf/en-b3u.pdf?src-supplier=Digi-Key; ComponentLink4URL: http://www.omron.com/ecb/products/pdf/en-b3u.pdf?src-supplier=Digi-Key; ComponentLink4Description: http://www.omron.com/ecb/products/pdf/en-b3u.pdf?src-supplier=Digi-Key; ComponentLink5URL: https://www.distrelec.biz/Web/Downloads/he/et/B3U_eng_datasheet.pdf?mime=application%2Fpdf&src-supplier=Distrelec; ComponentLink5Description: https://www.distrelec.biz/Web/Downloads/he/et/B3U_eng_datasheet.pdf?mime=application%2Fpdf&src-supplier=Distrelec; ComponentLink6URL: http://www.onlinecomponents.com/productFiles/mf-OM/en-b3u.pdf?src-supplier=Onlinecomponents.com; ComponentLink6Description: http://www.onlinecomponents.com/productFiles/mf-OM/en-b3u.pdf?src-supplier=Onlinecomponents.com; Supplier 1: Digi-Key; Manufacturer Part Number: B3U-1000P; Stock 1: 116454; Pricing 1: 1=1, 10=0.961, 25=0.9064, 50=0.7976, 100=0.7251, 250=0.68888, 500=0.67074, 1000=0.52571 (USD); Mount: Surface Mount; Weight: 0.000776oz; Contact Material: Silver; Min Operating Temperature: -25°C; Max Operating Temperature: 70°C; Packaging: Tape and Reel; Voltage Rating (DC): 12V; Package Quantity: 1; Max Current Rating: 50mA; Termination: SMD/SMT; Orientation: Straight; Max Voltage Rating (DC): 12V; Electrical Life: 200000Cycles; Insulation Resistance: 100MR; Contact Current Rating: 50mA; Length: 4mm; Height: 1.2mm; Depth: 2.5mm; Width: 3mm; REACH SVHC: Unknown; Lead Free: Lead Free; ComponentLink7URL: https://www.verical.com/server-webapp/html/getDatasheet?partID=552554&src-supplier=Verical; ComponentLink7Description: https://www.verical.com/server-webapp/html/getDatasheet?partID=552554&src-supplier=Verical; ComponentLink8URL: http://www.farnell.com/datasheets/1685550.pdf?src-supplier=Element14; ComponentLink8Description: http://www.farnell.com/datasheets/1685550.pdf?src-supplier=Element14; ComponentLink9URL: http://www.farnell.com/datasheets/2610940.pdf?src-supplier=Farnell; ComponentLink9Description: http://www.farnell.com/datasheets/2610940.pdf?src-supplier=Farnell; ComponentLink10URL: https://www.alliedelec.com/m/d/4c8a9ef82804fc3c241a13c1e298fd73.pdf?src-supplier=Allied+Electronics; ComponentLink10Description: https://www.alliedelec.com/m/d/4c8a9ef82804fc3c241a13c1e298fd73.pdf?src-supplier=Allied+Electronics; Supplier Part Number 1: SW1020DKR-ND; LCSC Part Number: C231329; Item Type: Switch
U14 = STM32F103CBT6: as U13 on sheet Sec_Controller_Sheet3; Supplier: Mouser; Supplier Part Number: 511-STM32F103CBT6; Manufacturer Part Number: STM32F103CBT6; RoHS: Yes; Category: Microcontrollers; Stock: 3552; Pricing: 1=7.35, 10=6.65, 50=5.53, 100=5.49, 1000=4.31, 10000=4.25 (USD); Case/Package: LQFP; Pins: 48; Min Operating Temperature: -40°C; Max Operating Temperature: 85°C; Package Quantity: 250; Density: 128KB; Packaging: Tray; Number of Programmable I/O: 37; Clock Frequency: 72MHz; Number of I2C Channels: 2; Memory Format: FLASH; Termination: SMD/SMT; Address Bus Width: 32b; Memory Size: 128KB; Series: STM32 F1; Length: 7mm; Width: 7.2mm; Height: 1.45mm; Radiation Hardening: No; Reach SVHC Compliant: No; Lead Free: Lead Free; RoHS Compliant: Yes; ComponentLink1URL: https://datasheet.ciiva.com/23669/1714663-23669200.pdf?src-supplier=Newark; ComponentLink1Description: https://datasheet.ciiva.com/23669/1714663-23669200.pdf?src-supplier=Newark; ComponentLink2URL: https://datasheet.ciiva.com/15122/getdatasheetpartid-92132-15122195.pdf?src-supplier=Verical; ComponentLink2Description: https://datasheet.ciiva.com/15122/getdatasheetpartid-92132-15122195.pdf?src-supplier=Verical; ComponentLink3URL: https://datasheet.ciiva.com/5752/cd00161566-5752838.pdf?src-supplier=Farnell; ComponentLink3Description: https://datasheet.ciiva.com/5752/cd00161566-5752838.pdf?src-supplier=Farnell; ComponentLink4URL: https://datasheet.ciiva.com/14100/pustm-arm-microcont-stm32f103-en-14100509.pdf?src-supplier=Distrelec; ComponentLink4Description: https://datasheet.ciiva.com/14100/pustm-arm-microcont-stm32f103-en-14100509.pdf?src-supplier=Distrelec; ComponentLink5URL: https://datasheet.ciiva.com/1502/cd00161566-1502328.pdf?src-supplier=Digi-Key; ComponentLink5Description: https://datasheet.ciiva.com/1502/cd00161566-1502328.pdf?src-supplier=Digi-Key; ComponentLink6URL: https://datasheet.ciiva.com/4840/cd00161566-4840398.pdf?src-supplier=Mouser; ComponentLink6Description: https://datasheet.ciiva.com/4840/cd00161566-4840398.pdf?src-supplier=Mouser; ComponentLink7URL: https://datasheet.ciiva.com/16219/cd00161566-16219150.pdf?src-supplier=Future+Electronics; ComponentLink7Description: https://datasheet.ciiva.com/16219/cd00161566-16219150.pdf?src-supplier=Future+Electronics; Item Type: IC; LCSC Part Number: C8304
U51 U52 = MCP23017T-E/SS: as U49 on sheet Sec_Controller_Sheet3; Supplier 1: Digi-Key; Manufacturer Part Number: MCP23017T-E/SS; RoHS: Yes; Category: Interface ICs; Stock 1: 26314; Pricing 1: 1=1.69, 25=1.4, 100=1.28 (USD); Mounting Technology: Surface Mount; Case/Package: SSOP; Pins: 28; Min Operating Temperature: -40°C; Max Operating Temperature: 125°C; Package Quantity: 2100; Series: -; Packaging: Tape and Reel; Frequency: 1.7MHz; Number of Bits: 16; Nominal Supply Voltage: 5.5V; Lead Free: Lead Free; RoHS Compliant: Yes; ComponentLink1URL: https://datasheet.ciiva.com/12267/21952b-12267583.pdf?src-supplier=Mouser; ComponentLink1Description: https://datasheet.ciiva.com/12267/21952b-12267583.pdf?src-supplier=Mouser; ComponentLink2URL: https://datasheet.ciiva.com/8128/21952b-8128586.pdf?src-supplier=Avnet; ComponentLink2Description: https://datasheet.ciiva.com/8128/21952b-8128586.pdf?src-supplier=Avnet; ComponentLink3URL: https://datasheet.ciiva.com/16454/filehandler-aspxddocname-en023709-16454267.pdf?src-supplier=Future+Electronics; ComponentLink3Description: https://datasheet.ciiva.com/16454/filehandler-aspxddocname-en023709-16454267.pdf?src-supplier=Future+Electronics; ComponentLink4URL: https://datasheet.ciiva.com/1780/21952b-1780738.pdf?src-supplier=Digi-Key; ComponentLink4Description: https://datasheet.ciiva.com/1780/21952b-1780738.pdf?src-supplier=Digi-Key; Supplier Part Number 1: MCP23017T-E/SSCT-ND; LCSC Part Number: C558584; Item Type: IC
X9 = MC-306 32.7680K-A0:ROHS: as X7 on sheet Sec_Controller_Sheet3; Manufacturer Part Number: MC-306 32.7680K-A0:ROHS; Item Type: Crystal; LCSC Part Number: C2650464; ComponentLink1Description: LCSC; ComponentLink1URL: https://www.lcsc.com/product-detail/Crystals_Seiko-Epson-MC-306-32-7680K-A0-ROHS_C2650464.html
X10 = 5TJ480000XYLBC: as X8 on sheet Sec_Controller_Sheet3; Manufacturer Part Number: 5TJ480000XYLBC; ComponentLink1Description: LCSC; ComponentLink1URL: https://www.lcsc.com/product-detail/Crystals_JYJE-5TJ480000XYLBC_C2149247.html; Package: SMD5032-4P; LCSC Part Number: C2149247; Item Type: Crystal